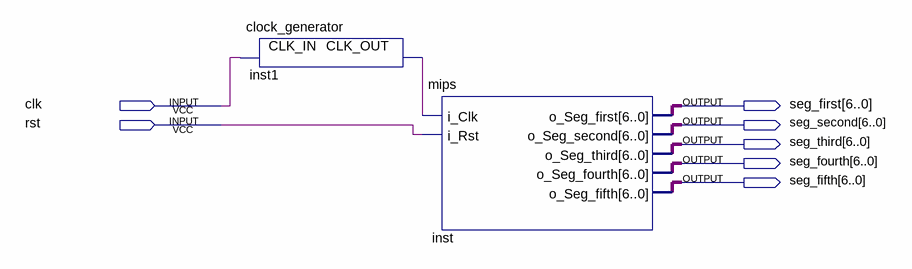
[diagram p0: schematic sheet]
// Quartus schematic mips_processor.bdf as structural Verilog: 2 symbols, 7 pins
module mips_processor (
  input  clk,
  input  rst,
  output [6:0] seg_first,
  output [6:0] seg_second,
  output [6:0] seg_third,
  output [6:0] seg_fourth,
  output [6:0] seg_fifth
);

  wire inst1_clk_out;

  clock_generator inst1 (.CLK_IN(clk), .CLK_OUT(inst1_clk_out));
  mips inst (
    .i_Clk(inst1_clk_out), .i_Rst(rst), .o_Seg_first(seg_first), .o_Seg_second(seg_second),
    .o_Seg_third(seg_third), .o_Seg_fourth(seg_fourth), .o_Seg_fifth(seg_fifth));
endmodule
